# Altium schematic sheet Top.SchDoc
size A4; SheetNumber: 1; SheetTotal: 6
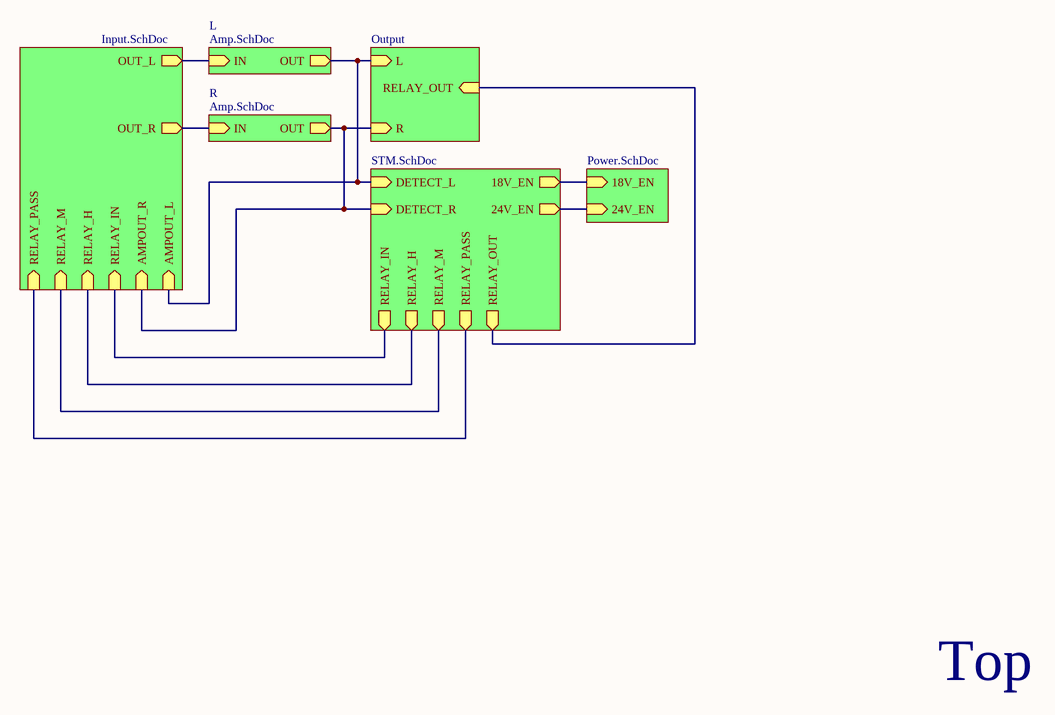
[diagram p0: Top.SchDoc]

## Sub-sheets
In = Input.SchDoc: OUT_L (out), OUT_R (out), RELAY_IN (in), RELAY_H (in), RELAY_M (in), AMPOUT_L (in), AMPOUT_R (in), RELAY_PASS (in)
L = Amp.SchDoc: IN (in), OUT (out)
Output = Output.SchDoc: L (in), R (in), RELAY_OUT (in)
Power = Power.SchDoc: 18V_EN (in), 24V_EN (in)
R = Amp.SchDoc: IN (in), OUT (out)
STM = STM.SchDoc: DETECT_L (in), DETECT_R (in), 18V_EN (out), 24V_EN (out), RELAY_IN (out), RELAY_H (out), RELAY_M (out), RELAY_PASS (out), RELAY_OUT (out)

## Nets
(unnamed): sheet L/IN, sheet In/OUT_L
(unnamed): sheet L/OUT, sheet STM/DETECT_L, sheet In/AMPOUT_L, sheet Output/L
(unnamed): sheet R/IN, sheet In/OUT_R
(unnamed): sheet R/OUT, sheet STM/DETECT_R, sheet In/AMPOUT_R, sheet Output/R
(unnamed): sheet Power/18V_EN, sheet STM/18V_EN
(unnamed): sheet Power/24V_EN, sheet STM/24V_EN
(unnamed): sheet STM/RELAY_IN, sheet In/RELAY_IN
(unnamed): sheet STM/RELAY_H, sheet In/RELAY_H
(unnamed): sheet STM/RELAY_M, sheet In/RELAY_M
(unnamed): sheet STM/RELAY_PASS, sheet In/RELAY_PASS
(unnamed): sheet STM/RELAY_OUT, sheet Output/RELAY_OUT

## Notes on the sheet
- Top